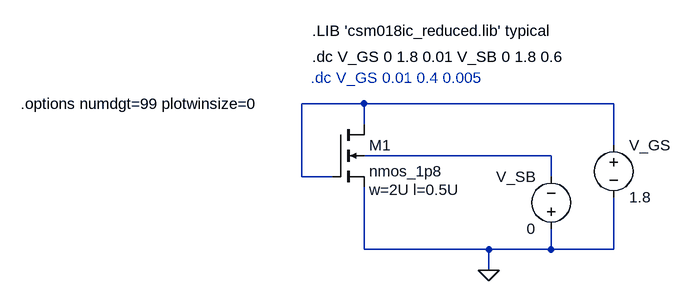
[diagram p0: schematic nmos_id_vgs.asc]
nmos_id_vgs.asc, the LTspice schematic file:
Version 4
SHEET 1 880 680
WIRE 288 192 192 192
WIRE 672 192 288 192
WIRE 288 224 288 192
WIRE 672 256 672 192
WIRE 576 272 288 272
WIRE 192 304 192 192
WIRE 240 304 192 304
WIRE 576 304 576 272
WIRE 288 416 288 320
WIRE 480 416 288 416
WIRE 576 416 576 384
WIRE 576 416 480 416
WIRE 672 416 672 336
WIRE 672 416 576 416
WIRE 480 448 480 416
FLAG 480 448 0
SYMBOL nmos4 240 224 R0
WINDOW 123 56 100 Left 2
SYMATTR Value2 w=2U l=0.5U
SYMATTR InstName M1
SYMATTR Value nmos_1p8
SYMBOL voltage 672 240 R0
SYMATTR InstName V_GS
SYMATTR Value 1.8
SYMBOL voltage 576 400 R180
WINDOW 0 24 96 Left 2
WINDOW 3 24 16 Left 2
WINDOW 123 0 0 Left 0
WINDOW 39 0 0 Left 0
SYMATTR InstName V_SB
SYMATTR Value 0
TEXT 208 80 Left 2 !.LIB 'csm018ic_reduced.lib' typical
TEXT 208 120 Left 2 !.dc V_GS 0 1.8 0.01 V_SB 0 1.8 0.6
TEXT -240 192 Left 2 !.options numdgt=99 plotwinsize=0
TEXT 206 152 Left 2 ;.dc V_GS 0.01 0.4 0.005

The netlist it stands for:
* nmos_id_vgs.asc
M1 N001 N001 0 N002 nmos_1p8 w=2U l=0.5U
V_GS N001 0 1.8
V_SB 0 N002 0
.model NMOS NMOS
.model PMOS PMOS
.lib standard.mos
.LIB 'csm018ic_reduced.lib' typical
.dc V_GS 0 1.8 0.01 V_SB 0 1.8 0.6
.options numdgt=99 plotwinsize=0
* .dc V_GS 0.01 0.4 0.005
.backanno
.end